# EAGLE design main (EAGLE 7.5.0)
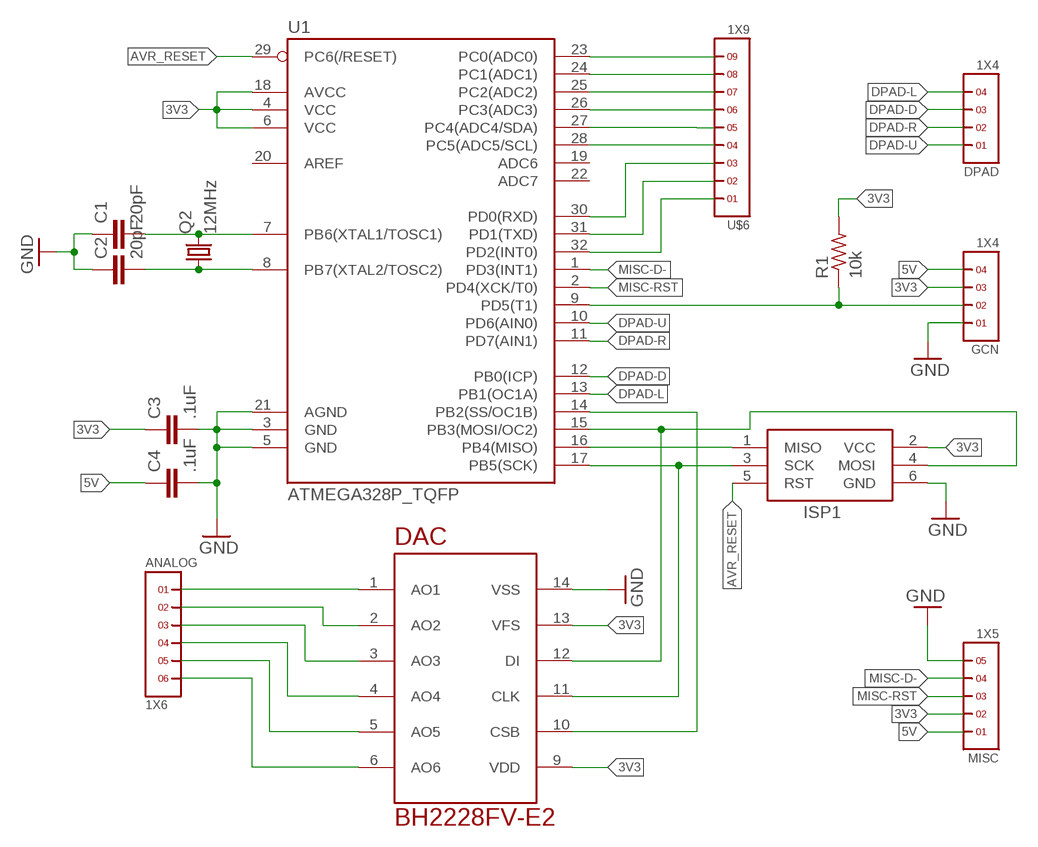
[diagram p0: schematic, sheet 1]

## Parts
ANALOG  1X6  [1X6]
C1  20pF  C-EUC0603  [C0603]
C2  20pF  C-EUC0603  [C0603]
C3  .1uF  C-EUC0603  [C0603]
C4  .1uF  C-EUC0603  [C0603]
DAC  BH2228FV-E2  [TSSOP14]
DPAD  1X4  [1X4]
GCN  1X4  [1X4]
ISP1  AVRISP-6  [AVRISP]
MISC  1X5  [1X5]
Q2  12MHz  CRYSTALHC49S  [HC49/S]
R1  10k  R-US_R0603  [R0603]
U1  ATMEGA328P_TQFP  [TQFP32-08]
U$6  1X9  [1X9]

## Nets
3V3: C3.1 DAC.9(VDD) DAC.13(VFS) GCN.3 ISP1.2(VCC) MISC.2 R1.2 U1.4(VCC) U1.6(VCC) U1.18(AVCC)
5V: C4.1 GCN.4 MISC.1
A: U1.23(PC0(ADC0)) U$6.9
AVR_RESET: ISP1.5(RST) U1.29(PC6(/RESET))
B: U1.24(PC1(ADC1)) U$6.8
DPAD-D: DPAD.3 U1.12(PB0(ICP))
DPAD-L: DPAD.4 U1.13(PB1(OC1A))
DPAD-R: DPAD.2 U1.11(PD7(AIN1))
DPAD-U: DPAD.1 U1.10(PD6(AIN0))
GCN_SIG: GCN.2 R1.1 U1.9(PD5(T1))
GND: C1.1 C2.1 C3.2 C4.2 DAC.14(VSS) GCN.1 ISP1.6(GND) MISC.5 U1.3(GND) U1.5(GND) U1.21(AGND)
L: U1.27(PC4(ADC4/SDA)) U$6.5
MENU: U1.30(PD0(RXD)) U$6.3
MISC-D-: MISC.4 U1.1(PD3(INT1))
MISC-RST: MISC.3 U1.2(PD4(XCK/T0))
MOSI: DAC.12(DI) ISP1.4(MOSI) U1.15(PB3(MOSI/OC2))
N$1: C1.2 Q2.2 U1.7(PB6(XTAL1/TOSC1))
N$2: C2.2 Q2.1 U1.8(PB7(XTAL2/TOSC2))
N$4: ISP1.1(MISO) U1.16(PB4(MISO))
R: U1.28(PC5(ADC5/SCL)) U$6.4
SCK: DAC.11(CLK) ISP1.3(SCK) U1.17(PB5(SCK))
SS: DAC.10(CSB) U1.14(PB2(SS/OC1B))
VIEW: U1.32(PD2(INT0)) U$6.1
X: U1.25(PC2(ADC2)) U$6.7
X1: ANALOG.1 DAC.1(AO1)
X2: ANALOG.4 DAC.4(AO4)
XBOX: U1.31(PD1(TXD)) U$6.2
Y: U1.26(PC3(ADC3)) U$6.6
Y1: ANALOG.2 DAC.2(AO2)
Y2: ANALOG.5 DAC.5(AO5)
Z1: ANALOG.3 DAC.3(AO3)
Z3: ANALOG.6 DAC.6(AO6)
Unconnected: U1.19(ADC6) U1.20(AREF) U1.22(ADC7)

## Library data of the parts
ANALOG = headers(2mm):1X6
C1-C4 = resistor:C-EU: CAPACITOR, European symbol
DAC = xbox-one-adapter-parts:BH2228FV-E2: 6 Channel, 8-bit DAC The BH2227FV and BH2228FV ICs are 8bit R-2R-type D/A converters with 4 and 6 channels, respectively. Optimized circuitry allows two output voltages to be supplied (3V/5V). Furthermore, the built-in RESET function ensures that the output voltage at allchannels is LOW during power up. A broad power supply voltage range is available (2.7V to 5.5V), providing design flexibility.
DPAD GCN = headers(2mm):1X4
ISP1 = adafruit:AVRISP: AVR ISP HEADER Standard 6 pin header for AVR programming
MISC = headers(2mm):1X5
Q2 = crystal:CRYSTAL: CRYSTAL; OC_FARNELL: 1667008; OC_NEWARK: unknown
R1 = resistor:R-US_: RESISTOR, American symbol
U1 = SparkFun-DigitalIC:ATMEGA328P_TQFP; PROD_ID: IC-09069
U$6 = headers(2mm):1X9

## Board
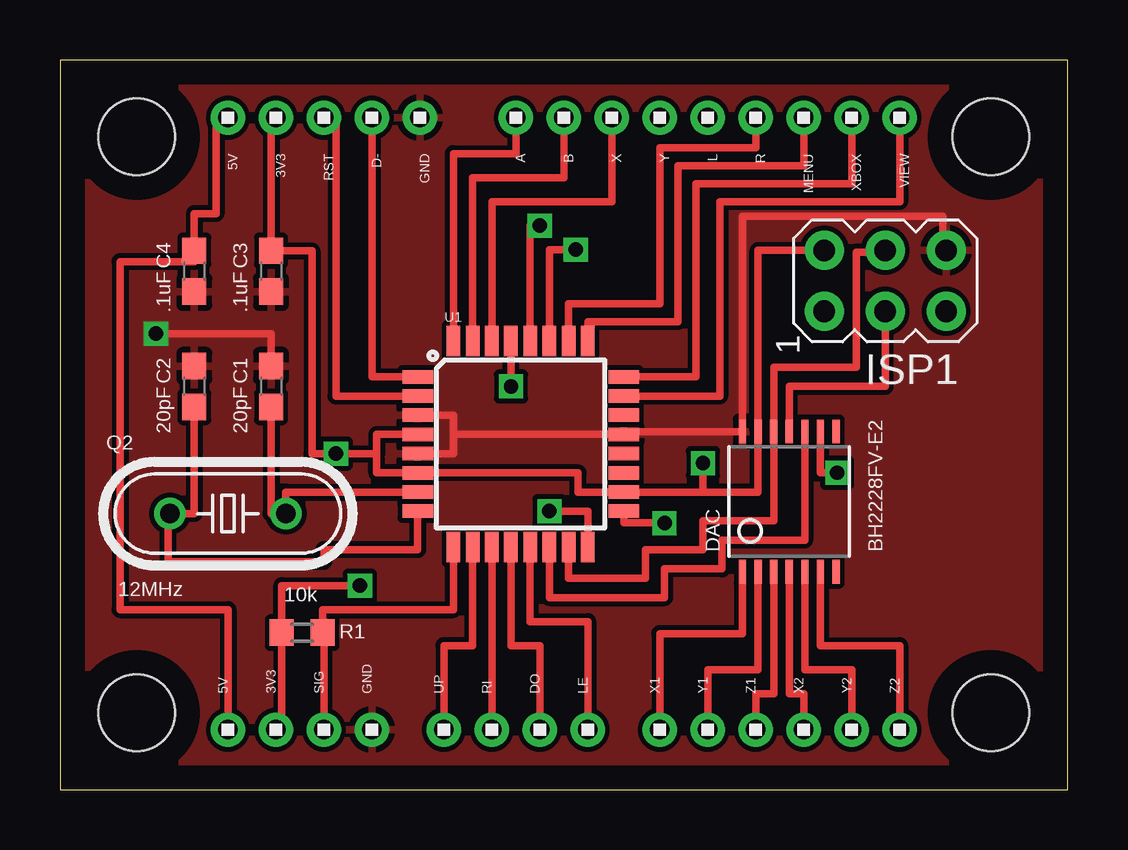
[diagram p1: board, top side]
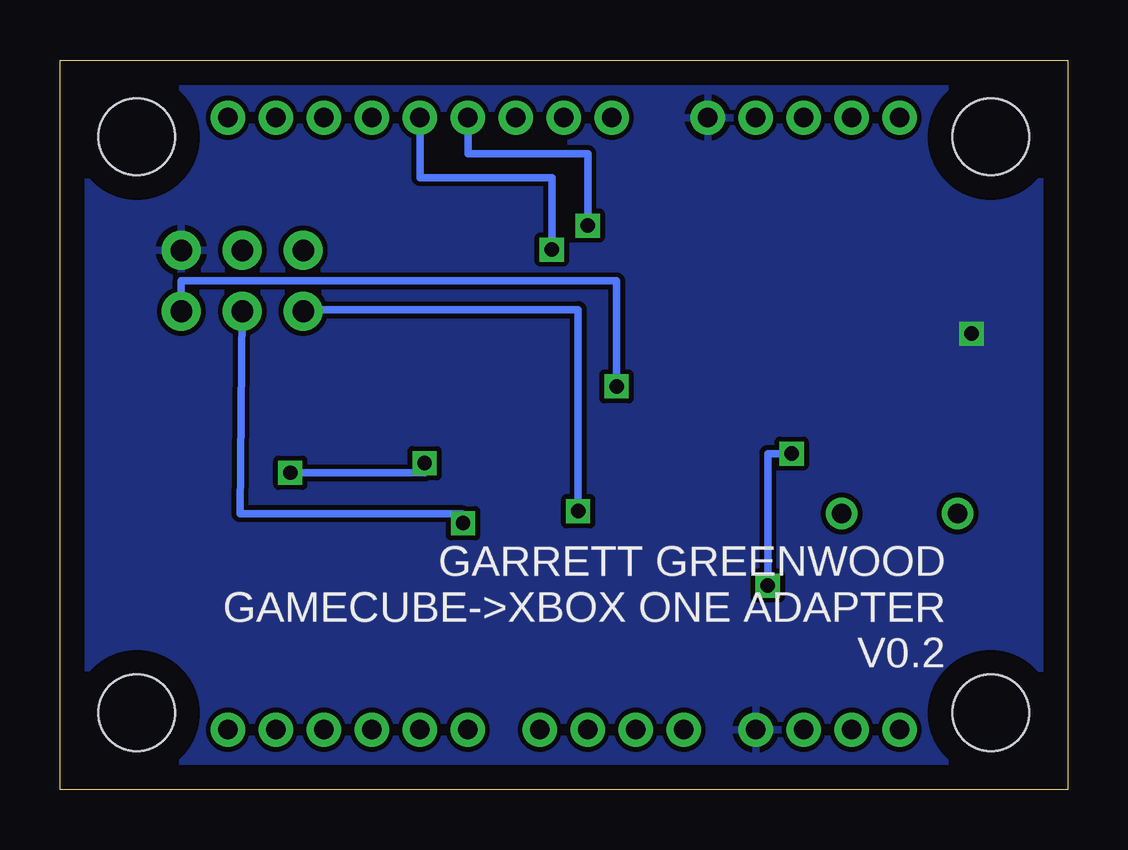
[diagram p2: board, bottom side, seen from below]

Size 42 x 30.4 mm. Coordinates in mm from the lower left corner, seen from the top.
Outline: 0,0 42,0 42,30.4 0,30.4 0,0
Copper layers (1*16): Top 0.035mm / dielectric 1.5mm / Bottom 0.035mm
Design rules "default": minimum track width 10mil, minimum drill 24mil, track to track 8mil, track to pad 8mil, pad to pad 8mil, via to via 8mil, smd to smd 8mil, copper to edge 40mil, drill to drill 8mil, minimum pad ring 10mil, minimum via ring 8mil, stop-mask expansion 4mil, vias tented up to drill 0mil, thermal gap 10mil
Holes 3.2 mm at 3.2,3.2 38.8,3.2 3.2,27.2 38.8,27.2

### Footprints (pad centres in the part's own frame; a part is rotated, then mirrored left to right if it is on the bottom)
1X6 = drill 0.8 pad 1.422: 1 -5,0; 2 -3,0; 3 -1,0; 4 1,0; 5 3,0; 6 5,0
C0603 = smd 1.1 x 1: 1 -0.85,0; 2 0.85,0
TSSOP14 = smd 0.305 x 0.991: 1 -1.95,-2.918; 2 -1.3,-2.918; 3 -0.65,-2.918; 4 0,-2.918; 5 0.65,-2.918; 6 1.3,-2.918; 7 1.95,-2.918; 8 1.95,2.918; 9 1.3,2.918; 10 0.65,2.918; 11 0,2.918; 12 -0.65,2.918; 13 -1.3,2.918; 14 -1.95,2.918
1X4 = drill 0.8 pad 1.422: 1 -3,0; 2 -1,0; 3 1,0; 4 3,0
AVRISP = drill 0.9 pad 1.626: 1 -1.27,2.54; 2 1.27,2.54; 3 -1.27,0; 4 1.27,0; 5 -1.27,-2.54; 6 1.27,-2.54
1X5 = drill 0.8 pad 1.422: 1 -4,0; 2 -2,0; 3 0,0; 4 2,0; 5 4,0
HC49/S = drill 0.813: 1 -2.413,0; 2 2.413,0
R0603 = smd 1 x 1.1: 1 -0.85,0; 2 0.85,0
TQFP32-08 = smd 1.27 x 0.559: 1 -4.293,2.8; 2 -4.293,2; 3 -4.293,1.2; 4 -4.293,0.4; 5 -4.293,-0.4; 6 -4.293,-1.2; 7 -4.293,-2; 8 -4.293,-2.8; 17 4.293,-2.8; 18 4.293,-2; 19 4.293,-1.2; 20 4.293,-0.4; 21 4.293,0.4; 22 4.293,1.2; 23 4.293,2; 24 4.293,2.8 | smd 0.559 x 1.27: 9 -2.8,-4.293; 10 -2,-4.293; 11 -1.2,-4.293; 12 -0.4,-4.293; 13 0.4,-4.293; 14 1.2,-4.293; 15 2,-4.293; 16 2.8,-4.293; 25 2.8,4.293; 26 2,4.293; 27 1.2,4.293; 28 0.4,4.293; 29 -0.4,4.293; 30 -1.2,4.293; 31 -2,4.293; 32 -2.8,4.293
1X9 = drill 0.8 pad 1.422: 1 -8,0; 2 -6,0; 3 -4,0; 4 -2,0; 5 0,0; 6 2,0; 7 4,0; 8 6,0; 9 8,0

### Placement (x,y rotation side)
ANALOG  30,2.5 0 top
C1  8.8,16.8 270 top
C2  5.6,16.8 270 top
C3  8.8,21.6 270 top
C4  5.6,21.6 270 top
DAC  30.4,12 0 top
DPAD  19,2.5 0 top
GCN  10,2.5 180 top
ISP1  34.4,21.2 90 top
MISC  11,28 0 top
Q2  7,11.5 0 top
R1  10.1,6.54 180 top
U1  19.2,14.4 0 top
U$6  27,28 0 top

### Tracks (layer width: path | path; a pad name or v marks a point on that pad's centre or on a via)
3V3  (via drill 0.6)
  Top 0.305: 13.2,14 13.2,13.2 U1.6 21.6,13.2 21.6,12.4 U1.18 26.8,12.4 | U1.4 13.2,14.8 13.2,14 | ISP1.2 29.1,22.47 DAC.13 29.1,12.4 26.8,12.4 | DAC.9 31.7,13.2 v32.4,13.2 | v26.8,13.6 26.8,12.4 | MISC.2 8.8,28 C3.1 10.5,22.45 10.5,14 v11.5,14 13.2,14 | GCN.3 9.24,2.5 R1.2 9.24,8.5 v12.5,8.5
  Bottom 0.305: v32.4,13.2 26.8,13.2 v26.8,13.6 | v12.5,8.5 12.5,14 v11.5,14
5V
  Top 0.305: MISC.1 6.5,28 6.5,24 5.6,24 C4.1 5.6,22 2.5,22 2.5,7.5 7,7.5 GCN.4
A
  Top 0.305: U$6.9 35,24.5 27.5,24.5 27.5,16.4 U1.23
AVR_RESET  (via drill 0.6)
  Top 0.305: v18.8,16.8 U1.29
  Bottom 0.305: ISP1.5 36.94,21.2 18.8,21.2 v18.8,16.8
B
  Top 0.305: U$6.8 33,25.25 26.5,25.25 26.5,17.2 U1.24
DPAD-D
  Top 0.305: U1.12 18.8,6 20,6 DPAD.3
DPAD-L
  Top 0.305: U1.13 19.6,7 22,7 DPAD.4
DPAD-R
  Top 0.305: U1.11 DPAD.2
DPAD-U
  Top 0.305: U1.10 17.2,6 16,6 DPAD.1
GCN_SIG
  Top 0.305: GCN.2 11,7.04 R1.1 10.95,7.5 16.4,7.5 U1.9
GND  (via drill 0.6)
  Top 0.305: U1.3 16.4,15.6 16.4,14.8 | 16.4,14.8 16.4,14 U1.5 | ISP1.6 36.8,22.47 36.8,23.9 28.45,23.9 DAC.14 23.49,14.92 U1.21 16.4,14.8 | C1.1 8.8,19 v4,19
  pour Bottom: 0,30.4 42,30.4 42,0 0,0
  pour Top: 5.2,20.8 9.2,20.8 9.2,17.2 5.2,17.2
  pour Top: 0,30.48 42.01,30.48 42.01,0 0,0
L  (via drill 0.6)
  Top 0.305: U1.27 20.4,22.5 v21.5,22.5
  Bottom 0.305: v21.5,22.5 21.5,25.5 27,25.5 U$6.5
MENU
  Top 0.305: U1.30 18,24.5 23,24.5 U$6.3
MISC-D-
  Top 0.305: MISC.4 13,17.2 U1.1
MISC-RST
  Top 0.305: U1.2 11.5,16.4 11.5,28 MISC.3
MOSI
  Top 0.305: U1.15 21.2,8.8 24.4,8.8 24.4,10 26.8,10 26.8,11.2 29.75,11.2 DAC.12 29.75,17.6 33.2,17.6 33.2,22.4 34.4,22.4 ISP1.4
N$1
  Top 0.305: C1.2 8.8,11.5 Q2.2 9.41,12.4 U1.7
N$2
  Top 0.305: C2.2 5.6,11.5 Q2.1 4.5,11.5 4.5,9.5 11,9.5 11,10 14.91,10 U1.8
N$4  (via drill 0.6)
  Top 0.305: U1.16 22,11.6 v20.4,11.6
  Bottom 0.305: ISP1.1 31.86,20 20.4,20 v20.4,11.6
R  (via drill 0.6)
  Top 0.305: U1.28 19.6,23.5 v20,23.5
  Bottom 0.305: v20,23.5 20,26.5 25,26.5 U$6.4
SCK  (via drill 0.6)
  Top 0.305: DAC.11 30.4,16.8 34.4,16.8 ISP1.3 | U1.17 23.5,11.12 25.25,11.12 v25.2,11.1
  Bottom 0.305: v25.2,11.1 25.25,11.12 25.25,11.5 34.5,11.5 ISP1.3
SS
  Top 0.305: U1.14 20.4,8 25.2,8 25.2,9.2 27.6,9.2 27.6,10.4 31.05,10.4 DAC.10
VIEW
  Top 0.305: U1.32 16.4,26.5 19,26.5 U$6.1
X
  Top 0.305: U$6.7 31,26 25.75,26 25.75,19.5 22,19.5 U1.25
X1
  Top 0.305: DAC.1 28.45,6.5 25,6.5 ANALOG.1
X2
  Top 0.305: DAC.4 30.4,4 31,4 ANALOG.4
XBOX
  Top 0.305: U1.31 17.2,25.5 21,25.5 U$6.2
Y
  Top 0.305: U1.26 21.2,20.25 25,20.25 25,26.75 29,26.75 U$6.6
Y1
  Top 0.305: DAC.2 29.1,5 27,5 ANALOG.2
Y2
  Top 0.305: DAC.5 31.05,5 33,5 ANALOG.5
Z1
  Top 0.305: DAC.3 29.75,4 29,4 ANALOG.3
Z3
  Top 0.305: DAC.6 31.7,6 35,6 ANALOG.6

### Text on the board
tNames: 5V | 3V3 | RST | D- | GND | A | B | X | Y | L | R | MENU | XBOX | VIEW | 5V | 3V3 | SIG | GND | UP | RI | DO | LE | X1 | Y1 | Z1 | X2 | Y2 | Z2
bNames: GARRETT GREENWOOD / GAMECUBE->XBOX ONE ADAPTER / V0.2